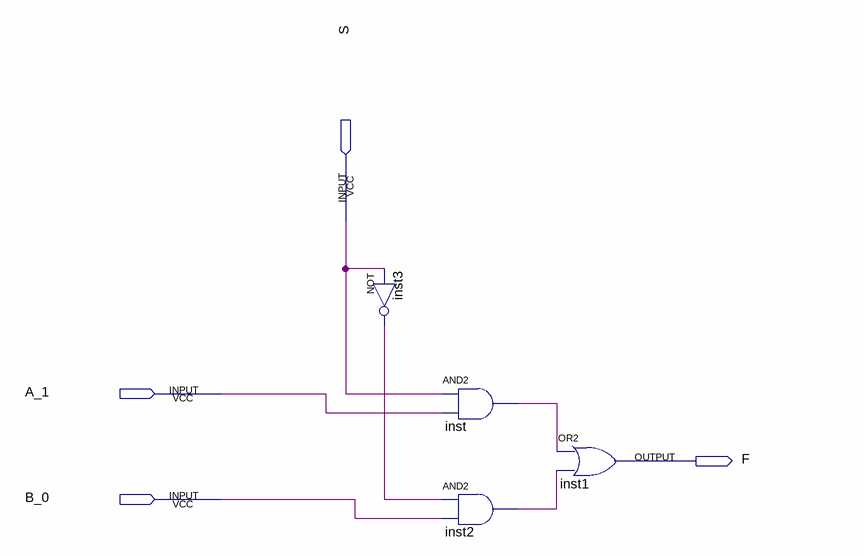
[diagram p0: schematic sheet]
// Quartus schematic mux_1bit.bdf as structural Verilog: 4 symbols, 4 pins
module mux_1bit (
  input  S,
  input  A_1,
  input  B_0,
  output F
);

  wire inst2_out, inst3_out, inst_out;

  not inst3 (inst3_out, S);
  and inst (inst_out, S, A_1);
  and inst2 (inst2_out, inst3_out, B_0);
  or inst1 (F, inst_out, inst2_out);
endmodule
